# Altium project Power_Distribution_2021.PrjPcb
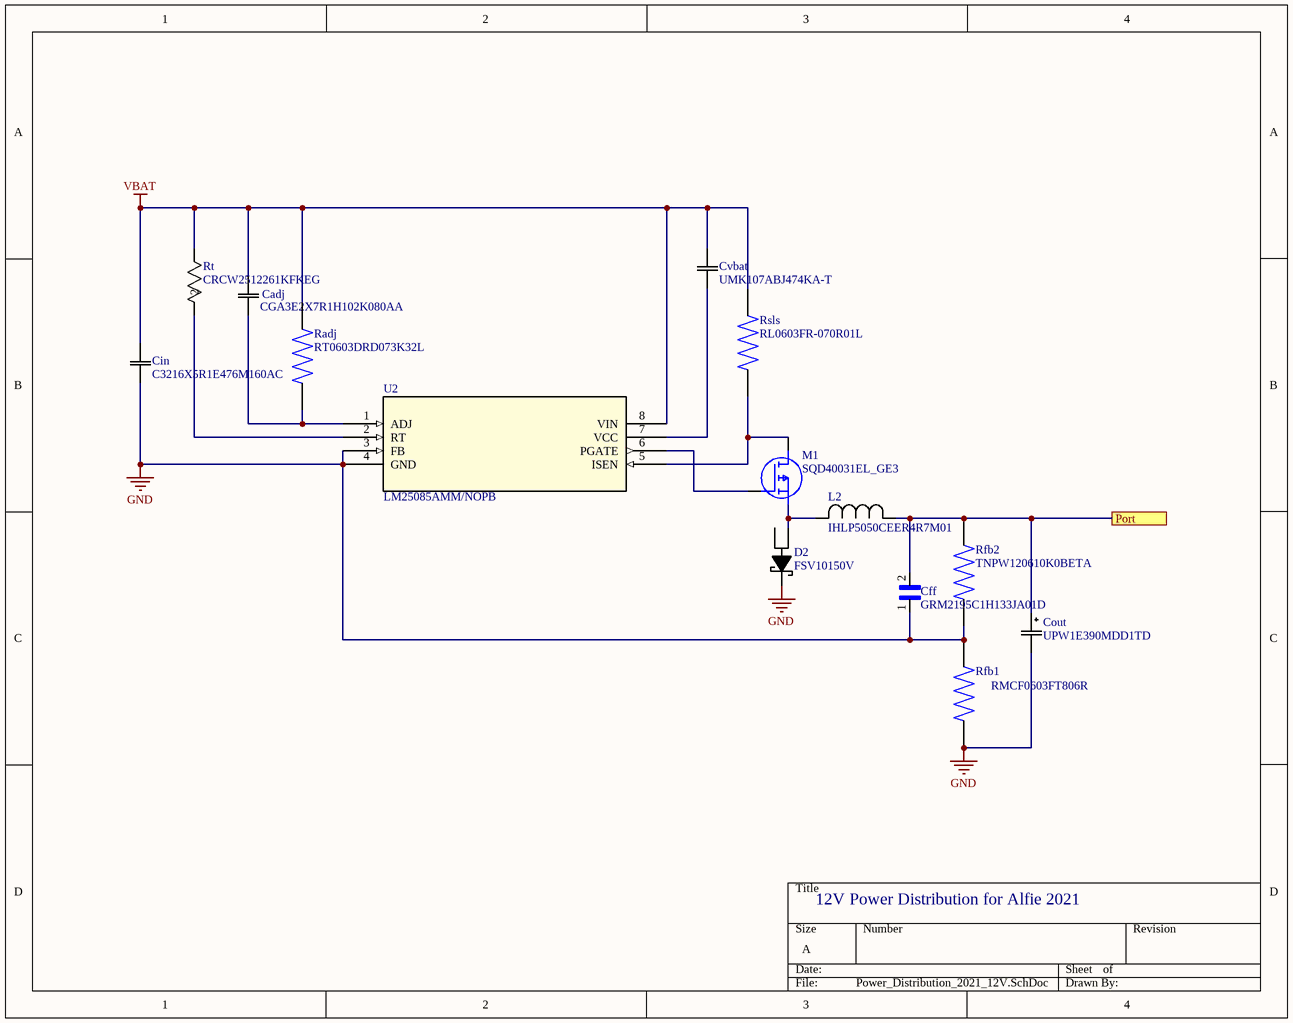
[diagram p0: Power_Distribution_2021_12V.SchDoc]
3 sheets, 40 parts. Net scope: flat (ports and power ports of the same name join across sheets).
Sheets:
  Power_Distribution_2021_12V.SchDoc
  Power_Distribution_2021_3V3.SchDoc
  Power_Distribution_2021_9V.SchDoc

## Sheet Power_Distribution_2021_12V.SchDoc
size A; SheetNumber: 1; SheetTotal: 3

### Parts
Cadj  CGA3E2X7R1H102K080AA  [CAP_1608_TDK]
Cff  GRM2195C1H133JA01D  [CAPC2012X95N]
Cin  C3216X5R1E476M160AC  [CAP_3216_TDK]
Cout  UPW1E390MDD1TD  [CAP_UEP_5X11_NCH]
Cvbat  UMK107ABJ474KA-T  [cap_UMK107ABJ474KA-T_TAY]
D2  FSV10150V  [TO-277_3L]
L2  IHLP5050CEER4R7M01  [IND_IHLP-5050CE_VIS]
M1  SQD40031EL_GE3  [SQD40031EL_GE3]
Radj  RT0603DRD073K32L  [RESC1608X55N]
Rfb1  RMCF0603FT806R  [RESC1508X55N]
Rfb2  TNPW120610K0BETA  [RESC3216X65N]
Rsls  RL0603FR-070R01L  [RESC1608X55N]
Rt  CRCW2512261KFKEG  [RC2512N_VIS]
U2  LM25085AMM/NOPB  [MUA08A]

### Ports
Port

### Nets
GND: Cff.1 Cin.1 Cout.2 D2.2 Rfb1.1 Rfb1.2 Rfb2.1 U2.3(FB) U2.4(GND)
VBAT: Cadj.2 Cin.2 Cvbat.1 Radj.2 Rsls.2 Rt.1 U2.8(VIN)
NetC5_2: Cff.2 Cout.1 L2.1 Rfb2.2 ; port Port
NetCadj_1: Cadj.1 Radj.1 U2.1(ADJ)
NetCvbat_2: Cvbat.2 U2.7(VCC)
NetD2_0: D2.0 L2.2 M1.2(S)
NetM1_1: M1.1(G) U2.6(PGATE)
NetM1_3: M1.3(D) Rsls.1 U2.5(ISEN)
NetRt_2: Rt.2 U2.2(RT)

Not connected (* = marked no-connect by the designer): D2 1

### Notes on the sheet
- 12V Power Distribution for Alfie 2021

### Library data of the parts
Cadj = CGA3E2X7R1H102K080AA: CAP CER 1000PF 50V X7R 0603; Vendor: TDK; Built_By: EMA_UL_Team; SourceLibrary: TDK_2015_05_22; Manufacturer_Part_Number: CGA3E2X7R1H102K080AA; Copyright: Copyright (C) 2021 Accelerated Designs. All rights reserved; RefDes: RefDes; Type: DEV
Cff = GRM2195C1H133JA01D: SMD Capacitor C0G(EIA) with Capacitance: 13000pF Tol. 5%. Rated Voltage: 50Vdc; Package: None; Price: None; Value: *; MP: GRM2195C1H133JA01D; Availability: Unavailable
Cin = C3216X5R1E476M160AC: CAP CER 47UF 25V X5R 1206; Vendor: TDK; Built_By: EMA_UL_Team; SourceLibrary: TDK_2015_05_22; Manufacturer_Part_Number: C3216X5R1E476M160AC; Copyright: Copyright (C) 2021 Accelerated Designs. All rights reserved; RefDes: RefDes; Type: DEV
Cout = UPW1E390MDD1TD: CAP ALUM 39UF 20% 25V RADIAL; Vendor: Nichicon; Built_By: EMA_Cory; SourceLibrary: Nichicon_2019-09-13; Manufacturer_Part_Number: UPW1E390MDD1TD; Copyright: Copyright (C) 2018 Accelerated Designs. All rights reserved; RefDes: RefDes; Type: DEV
Cvbat = UMK107ABJ474KA-T: CAP CER 0.47UF 50V X5R 0603; Vendor: Taiyo Yuden; Built_By: EMA_UL_Team; SourceLibrary: Taiyo_Yuden_2018-10-17; Manufacturer_Part_Number: UMK107ABJ474KA-T; Copyright: Copyright (C) 2018 Accelerated Designs. All rights reserved; RefDes: RefDes; Type: DEV
D2 = FSV10150V: DIODE SCHOTTKY 150V 10A TO277-3
L2 = IHLP5050CEER4R7M01: FIXED IND 4.7UH 10A 15 MOHM SMD; Vendor: VISHAY; Built_By: EMA_UL_Team; SourceLibrary: Vishay_2010-01-01_IND_IHLP; Type: DEV; Manufacturer_Part_Number: IHLP5050CEER4R7M01; Copyright: Copyright (C) 2021 Accelerated Designs. All rights reserved; RefDes: RefDes
M1 = SQD40031EL_GE3: MOSFET (P-Channel); Manufacturer_Name: Vishay; Datasheet Link: https://www.vishay.com/docs/76011/sqd40031el.pdf; Height: 2.38mm; Manufacturer_Part_Number: SQD40031EL_GE3
Radj = RT0603DRD073K32L: RES SMD 3.32KOHM 0.5% 1/10W 0603; Package: None; Price: None; Value: *; MP: RT0603DRD073K32L; Availability: Unavailable
Rfb1 = RMCF0603FT806R: RES 806 OHM 1% 1/10W 0603; Package: None; Price: None; Value: *; MP: RMCF0603FT806R; Availability: Unavailable
Rfb2 = TNPW120610K0BETA: Res Thin Film 1206 10K Ohm 0.1% 0.25W(1/4W) ?25ppm/C Molded SMD T/R; Package: None; Price: None; Value: *; MP: TNPW120610K0BETA; Availability: Unavailable
Rsls = RL0603FR-070R01L: .01 OHM 1% 1/10W; Package: None; Price: None; Value: *; MP: RL0603FR-070R01L; Availability: Unavailable
Rt = CRCW2512261KFKEG: RES SMD 261K OHM 1% 1W 2512; Vendor: Vishay; Built_By: EMA_UL_Team; SourceLibrary: Vishay_2010-01-01_Res1; Manufacturer_Part_Number: CRCW2512261KFKEG; Copyright: Copyright (C) 2021 Accelerated Designs. All rights reserved; RefDes: RefDes; Type: DEV
U2 = LM25085AMM/NOPB: IC REG CTRLR BUCK 8VSSOP; Vendor: National; Manufacturer_Part_Number: LM25085AMM/NOPB; Copyright: Copyright (C) 2021 Accelerated Designs. All rights reserved; RefDes: RefDes; Type: DEV

## Sheet Power_Distribution_2021_3V3.SchDoc
size A; SheetNumber: 2; SheetTotal: 4
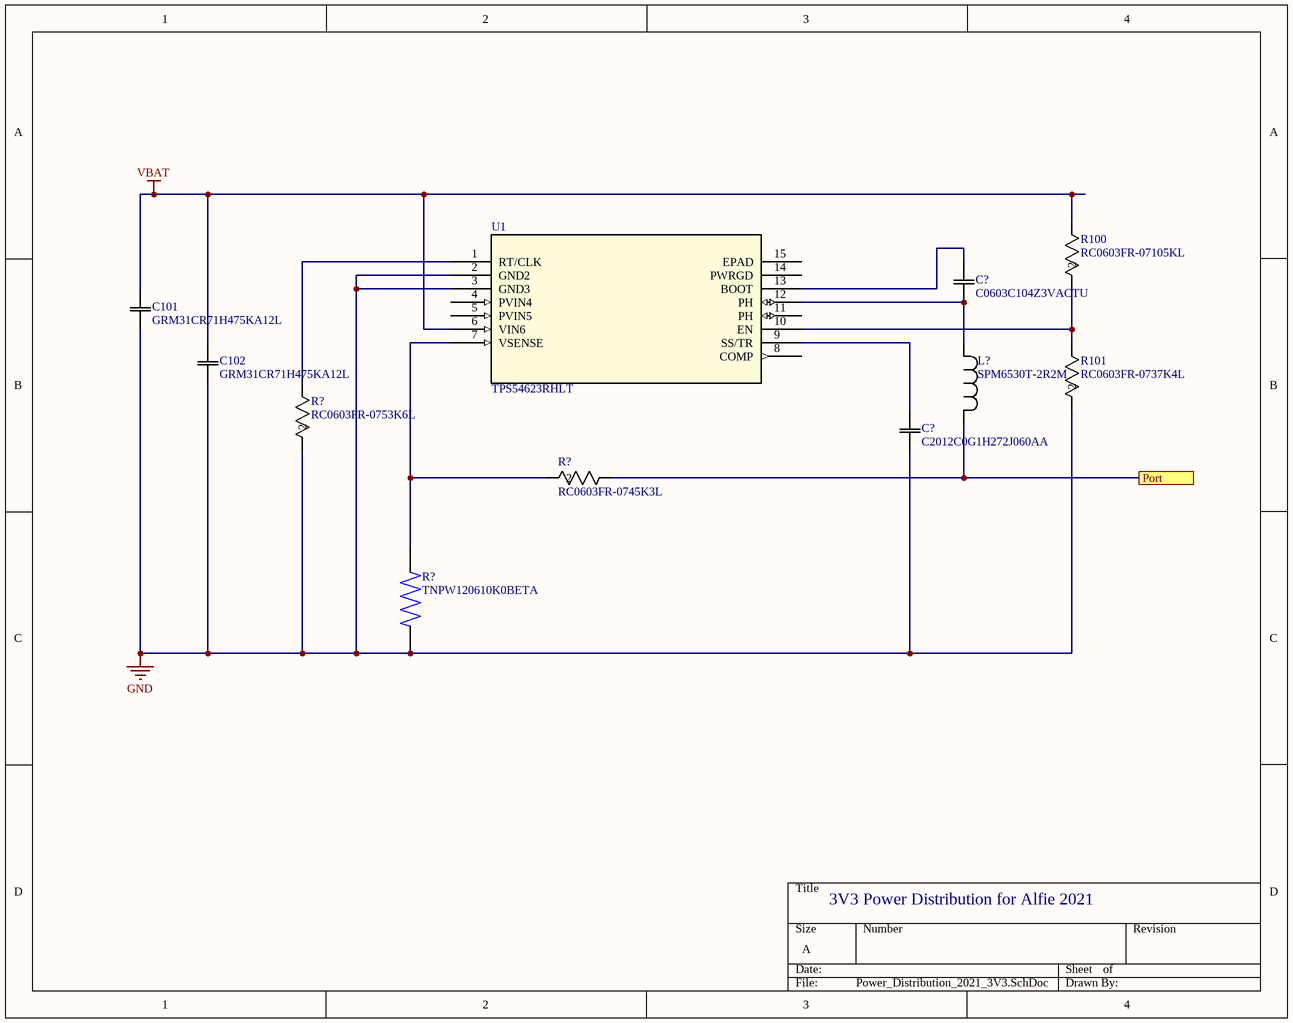
[diagram p1: Power_Distribution_2021_3V3.SchDoc]

### Parts
(Parts that share a designator on the sheet are numbered #1, #2 ... from top to bottom, then left to right.)
C101  GRM31CR71H475KA12L  [G-31_MUR]
C102  GRM31CR71H475KA12L  [G-31_MUR]
C?#1  C0603C104Z3VACTU  [CAPC17595_90N_KEM]
C?#2  C2012C0G1H272J060AA  [CAP_2012_TDK]
L?  SPM6530T-2R2M
R100  RC0603FR-07105KL  [RC0603N_YAG]
R101  RC0603FR-0737K4L  [RC0603N_YAG]
R?#1  RC0603FR-0753K6L  [RC0603N_YAG]
R?#2  RC0603FR-0745K3L  [RC0603N_YAG]
R?#3  TNPW120610K0BETA  [RESC3216X65N]
U1  TPS54623RHLT  [RHL14_2P05X2P05]

### Ports
Port

### Nets
GND: C101.1 C102.1 C?#2.1 R101.2 R?#1.2 R?#3.1 U1.2(GND2) U1.3(GND3)
VBAT: C101.2 C102.2 R100.1 U1.6(VIN6)
NetC5_2: L?.1 R?#2.1 ; port Port
NetC?#1_1: C?#1.1 U1.13(BOOT)
NetC?#1_2: C?#1.2 L?.2 U1.12(PH)
NetC?#2_2: C?#2.2 U1.9(SS/TR)
NetR100_2: R100.2 R101.1 U1.10(EN)
NetR?#1_1: R?#1.1 U1.1(RT/CLK)
NetR?#2_2: R?#2.2 R?#3.2 U1.7(VSENSE)

Not connected (* = marked no-connect by the designer): U1 4(PVIN4) 5(PVIN5) 8(COMP) 11(PH) 14(PWRGD) 15(EPAD)

### Notes on the sheet
- 3V3 Power Distribution for Alfie 2021

### Library data of the parts
C101 C102 = GRM31CR71H475KA12L: CAP CER 4.7UF 50V X7R 1206; Mfr_Name: Murata; Type: DEV; Copyright: Copyright (C) 2021 Ultra Librarian. All rights reserved.; Manufacturer_Part_Number: GRM31CR71H475KA12L; Digi-Key_Part_Number_1: 490-6521-1-ND; Digi-Key_Part_Number_2: 490-6521-2-ND; Digi-Key_Part_Number_3: 490-6521-6-ND; RefDes: RefDes
C?#1 = C0603C104Z3VACTU: CAP CER 0.1UF 25V Y5V 0603; Mfr_Name: Kemet; Type: DEV; Copyright: Copyright (C) 2021 Ultra Librarian. All rights reserved.; Manufacturer_Part_Number: C0603C104Z3VACTU; Digi-Key_Part_Number_1: 399-1100-1-ND; Digi-Key_Part_Number_2: 399-1100-2-ND; Digi-Key_Part_Number_3: 399-1100-6-ND; RefDes: RefDes
C?#2 = C2012C0G1H272J060AA: CAP CER 2700PF 50V C0G 0805; Mfr_Name: TDK; Type: DEV; Copyright: Copyright (C) 2021 Ultra Librarian. All rights reserved.; Manufacturer_Part_Number: C2012C0G1H272J060AA; Digi-Key_Part_Number_1: 445-7508-1-ND; Digi-Key_Part_Number_2: 445-7508-2-ND; Digi-Key_Part_Number_3: 445-7508-6-ND; RefDes: RefDes
L? = SPM6530T-2R2M: FIXED IND 2.2UH 8.2A 19 MOHM SMD; Mfr_Name: TDK; Copyright: Copyright (C) 2021 Ultra Librarian. All rights reserved.; Manufacturer_Part_Number: SPM6530T-2R2M; Digi-Key_Part_Number_1: 445-4118-1-ND; Digi-Key_Part_Number_2: 445-4118-2-ND; Digi-Key_Part_Number_3: 445-4118-6-ND
R100 = RC0603FR-07105KL: RES SMD 105K OHM 1% 1/10W 0603; Mfr_Name: Yageo; Copyright: Copyright (C) 2021 Ultra Librarian. All rights reserved.; Manufacturer_Part_Number: RC0603FR-07105KL; Digi-Key_Part_Number_1: 311-105KHRCT-ND; Digi-Key_Part_Number_2: 311-105KHRDKR-ND; Digi-Key_Part_Number_3: 311-105KHRTR-ND; RefDes: RefDes; Type: DEV
R101 = RC0603FR-0737K4L: RES SMD 37.4K OHM 1% 1/10W 0603; Mfr_Name: Yageo; Copyright: Copyright (C) 2021 Ultra Librarian. All rights reserved.; Manufacturer_Part_Number: RC0603FR-0737K4L; Digi-Key_Part_Number_1: 311-37.4KHRCT-ND; Digi-Key_Part_Number_2: 311-37.4KHRDKR-ND; Digi-Key_Part_Number_3: 311-37.4KHRTR-ND; Digi-Key_Part_Number_4: 311-37.4KHRTR-NDL; RefDes: RefDes; Type: DEV
R?#1 = RC0603FR-0753K6L: RES SMD 53.6K OHM 1% 1/10W 0603; Mfr_Name: Yageo; Copyright: Copyright (C) 2021 Ultra Librarian. All rights reserved.; Manufacturer_Part_Number: RC0603FR-0753K6L; Digi-Key_Part_Number_1: 311-53.6KHRCT-ND; Digi-Key_Part_Number_2: 311-53.6KHRDKR-ND; Digi-Key_Part_Number_3: 311-53.6KHRTR-ND; RefDes: RefDes; Type: DEV
R?#2 = RC0603FR-0745K3L: RES SMD 45.3K OHM 1% 1/10W 0603; Mfr_Name: Yageo; Copyright: Copyright (C) 2021 Ultra Librarian. All rights reserved.; Manufacturer_Part_Number: RC0603FR-0745K3L; Digi-Key_Part_Number_1: 311-45.3KHRCT-ND; Digi-Key_Part_Number_2: 311-45.3KHRDKR-ND; Digi-Key_Part_Number_3: 311-45.3KHRTR-ND; Digi-Key_Part_Number_4: 311-45.3KHRTR-NDL; RefDes: RefDes; Type: DEV
R?#3 = TNPW120610K0BETA: as Rfb2 on sheet Power_Distribution_2021_12V; Package: None; Price: None; Value: *; MP: TNPW120610K0BETA; Availability: Unavailable
U1 = TPS54623RHLT: No Description Available; Mfr_Name: Texas Instruments; Copyright: Copyright (C) 2021 Ultra Librarian. All rights reserved.; Manufacturer_Part_Number: TPS54623RHLT; Digi-Key_Part_Number_1: 296-29679-1-ND; Digi-Key_Part_Number_2: 296-29679-2-ND; Digi-Key_Part_Number_3: 296-29679-6-ND; RefDes: RefDes; Type: DEV

## Sheet Power_Distribution_2021_9V.SchDoc
size A; SheetNumber: 3; SheetTotal: 3
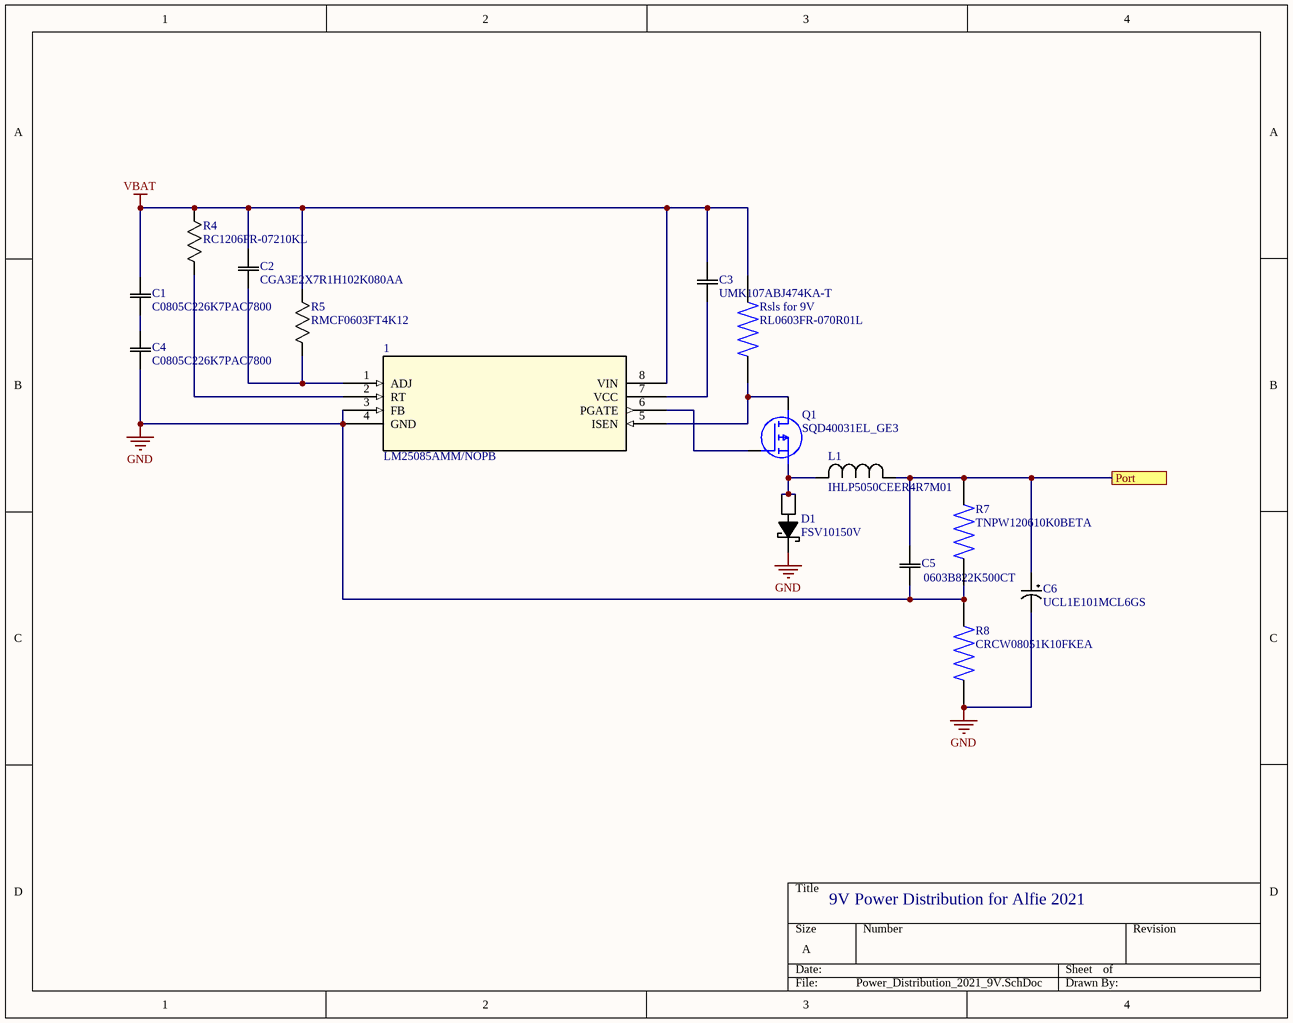
[diagram p2: Power_Distribution_2021_9V.SchDoc]

### Parts
1  LM25085AMM/NOPB  [MUA08A]
C1  C0805C226K7PAC7800  [CAPC2012X140N]
C2  CGA3E2X7R1H102K080AA  [CAP_1608_TDK]
C3  UMK107ABJ474KA-T  [cap_UMK107ABJ474KA-T_TAY]
C4  C0805C226K7PAC7800  [CAPC2012X140N]
C5  0603B822K500CT  [CAP_0603_S_WAL]
C6  UCL1E101MCL6GS  [U2-O_NCH]
D1  FSV10150V  [TO-277_3L]
L1  IHLP5050CEER4R7M01  [IND_IHLP-5050CE_VIS]
Q1  SQD40031EL_GE3  [SQD40031EL_GE3]
R4  RC1206FR-07210KL  [RC1206N_YAG]
R5  RMCF0603FT4K12  [STA_RMCF0603_STP]
R7  TNPW120610K0BETA  [RESC3216X65N]
R8  CRCW08051K10FKEA  [RESC2012X50N]
Rsls_for_9V  RL0603FR-070R01L  [RESC1608X55N]

### Ports
Port

### Nets
GND: 1.3(FB) 1.4(GND) C4.1 C5.1 C6.2 D1.2 R7.1 R8.1 R8.2
VBAT: 1.8(VIN) C1.2 C2.2 C3.1 R4.1 R5.2 Rsls_for_9V.2
Net1_1: 1.1(ADJ) C2.1 R5.1
Net1_2: 1.2(RT) R4.2
Net1_5: 1.5(ISEN) Q1.3(D) Rsls_for_9V.1
Net1_6: 1.6(PGATE) Q1.1(G)
Net1_7: 1.7(VCC) C3.2
NetC1_1: C1.1 C4.2
NetC5_2: C5.2 C6.1 L1.1 R7.2 ; port Port
NetD1_0: D1.0 D1.1 L1.2 Q1.2(S)

### Notes on the sheet
- 9V Power Distribution for Alfie 2021

### Library data of the parts
1 = LM25085AMM/NOPB: as U2 on sheet Power_Distribution_2021_12V; Manufacturer_Part_Number: LM25085AMM/NOPB; Copyright: Copyright (C) 2021 Accelerated Designs. All rights reserved; RefDes: RefDes; Type: DEV
C1 C4 = C0805C226K7PAC7800: 22µF ±10% 4V Ceramic Capacitor X5R 0805 _2012 Metric; MF: KEMET; SnapEDA_Link: https://www.snapeda.com/parts/C0805C226K7PAC7800/KEMET/view-part/3927428/?ref=snap; Price: None; Availability: Unavailable; Value: *; MP: C0805C226K7PAC7800; Package: 2012 KEMET
C2 = CGA3E2X7R1H102K080AA: CAP CER 1000PF 50V X7R 0603; Vendor: TDK; Built_By: EMA_UL_Team; SourceLibrary: TDK_2015_05_22; Type: DEV; Manufacturer_Part_Number: CGA3E2X7R1H102K080AA; Copyright: Copyright (C) 2021 Accelerated Designs. All rights reserved; RefDes: RefDes
C3 = UMK107ABJ474KA-T: CAP CER 0.47UF 50V X5R 0603; Vendor: Taiyo Yuden; Built_By: EMA_UL_Team; SourceLibrary: Taiyo_Yuden_2018-10-17; Type: DEV; Manufacturer_Part_Number: UMK107ABJ474KA-T; Copyright: Copyright (C) 2018 Accelerated Designs. All rights reserved; RefDes: RefDes
C5 = 0603B822K500CT: CAP CER 8200PF 50V X7R 0603; Vendor: Walsin; Built_By: EMA_UL_Team; SourceLibrary: Walsin_2016-07-18_2; Type: DEV; Manufacturer_Part_Number: 0603B822K500CT; Copyright: Copyright (C) 2021 Accelerated Designs. All rights reserved; RefDes: RefDes
C6 = UCL1E101MCL6GS: CAP ALUM 100UF 20% 25V SMD; Vendor: Nichicon; Built_By: EMA_UL_Team; SourceLibrary: Nichicon_2014-12-31; Type: DEV; Manufacturer_Part_Number: UCL1E101MCL6GS; Copyright: Copyright (C) 2021 Accelerated Designs. All rights reserved; RefDes: RefDes
D1 = FSV10150V: DIODE SCHOTTKY 150V 10A TO277-3
L1 = IHLP5050CEER4R7M01: as L2 on sheet Power_Distribution_2021_12V; Manufacturer_Part_Number: IHLP5050CEER4R7M01; Copyright: Copyright (C) 2021 Accelerated Designs. All rights reserved; RefDes: RefDes
Q1 = SQD40031EL_GE3: as M1 on sheet Power_Distribution_2021_12V; Datasheet Link: https://www.vishay.com/docs/76011/sqd40031el.pdf; Height: 2.38mm; Manufacturer_Part_Number: SQD40031EL_GE3
R4 = RC1206FR-07210KL: RES SMD 210K OHM 1% 1/4W 1206; Vendor: Yageo; Built_By: EMA_UL_Team; SourceLibrary: Yageo_2008-01-01_ChipRes2a; Manufacturer_Part_Number: RC1206FR-07210KL; Copyright: Copyright (C) 2021 Accelerated Designs. All rights reserved; RefDes: RefDes; Type: DEV
R5 = RMCF0603FT4K12: RES 4.12K OHM 1% 1/10W 0603; Vendor: Stackpole International; Built_By: EMA_UL_Team; SourceLibrary: Stackpole_2014-12-31; Manufacturer_Part_Number: RMCF0603FT4K12; Copyright: Copyright (C) 2021 Accelerated Designs. All rights reserved; RefDes: RefDes; Type: DEV
R7 = TNPW120610K0BETA: as Rfb2 on sheet Power_Distribution_2021_12V; Package: None; Price: None; Value: *; MP: TNPW120610K0BETA; Availability: Unavailable
R8 = CRCW08051K10FKEA: D12/Crcw0805 100 1K1 1% Et1 E3; Package: None; Price: None; Value: *; MP: CRCW08051K10FKEA; Availability: Unavailable
Rsls_for_9V = RL0603FR-070R01L: .01 OHM 1% 1/10W; Package: None; Price: None; Value: *; MP: RL0603FR-070R01L; Availability: Unavailable

## Nets that join several sheets
GND: Power_Distribution_2021_12V (9 pins), Power_Distribution_2021_3V3 (8 pins), Power_Distribution_2021_9V (9 pins)
VBAT: Power_Distribution_2021_12V (7 pins), Power_Distribution_2021_3V3 (C101.2 C102.2 R100.1 U1.6), Power_Distribution_2021_9V (7 pins)
NetC5_2: Power_Distribution_2021_12V (Cff.2 Cout.1 L2.1 Rfb2.2), Power_Distribution_2021_3V3 (L?.1 R?#2.1), Power_Distribution_2021_9V (C5.2 C6.1 L1.1 R7.2)